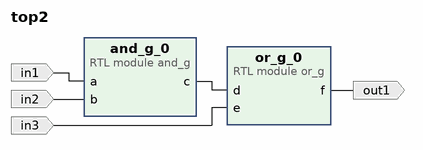
[diagram p0: block diagram of the top level]
# Vivado block design top2, xc7a100tcsg324-1, Vivado 2020.2
create_bd_design top2

create_bd_port -dir I in1
create_bd_port -dir I in2
create_bd_port -dir I in3
create_bd_port -dir O out1

create_bd_cell -type module -reference and_g and_g_0
create_bd_cell -type module -reference or_g or_g_0

# ---- connections ----

connect_bd_net [get_bd_pins and_g_0/c] [get_bd_pins or_g_0/d]
connect_bd_net -net a_0_1 [get_bd_ports in1] [get_bd_pins and_g_0/a]
connect_bd_net -net b_0_1 [get_bd_ports in2] [get_bd_pins and_g_0/b]
connect_bd_net -net e_0_1 [get_bd_ports in3] [get_bd_pins or_g_0/e]
connect_bd_net [get_bd_pins or_g_0/f] [get_bd_ports out1]

validate_bd_design
save_bd_design
